# EAGLE design WSTL18_ISP (EAGLE 7.7.0)
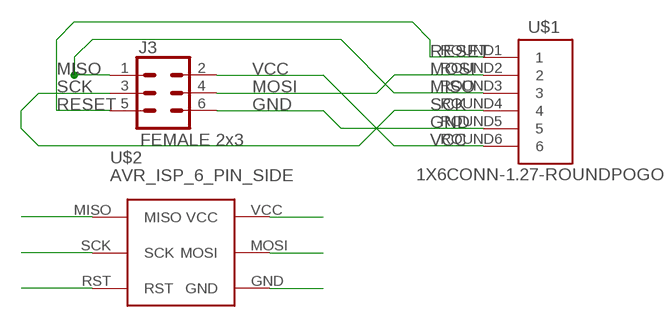
[diagram p0: schematic, sheet 1]

## Parts
J3  FEMALE 2x3  CONN_03X2FEMALE  [2X3]
U$1  1X6CONN-1.27-ROUNDPOGO  [1X6_1.27_SIDEPOGO]
U$2  AVR_ISP_6_PIN_SIDE  [AVR_ISP_SIDE_0.1_INCH]

## Nets
GND [GND]: J3.6 U$1.ROUND5 U$2.GND
MISO: J3.1 U$1.ROUND3 U$2.MISO
MOSI: J3.4 U$1.ROUND2 U$2.MOSI
RESET: J3.5 U$1.ROUND1 U$2.RST
SCK: J3.3 U$1.ROUND4 U$2.SCK
VCC: J3.2 U$1.ROUND6 U$2.VCC

## Library data of the parts
J3 = SparkFun-Connectors:CONN_03X2: Multi connection point. Often used as Generic Header-pin footprint for 0.1 inch spaced/style header connections You can populate with any combo of single row headers, but if you'd like an exact match, check these: Header - 2x3 (Male, 0.1") <https://www.sparkfun.com/products/12807> (PRT-12807) Header - 2x3 (Female, 0.1") <https://www.sparkfun.com/products/13010> (PRT-13010) 2x3 Pin Shrouded Header <https://www.sparkfun.com/products/10877> (PRT-10877) On any of the 0.1 inch spaced packages, you can populate with these: Break Away Headers - Straight <https://www.sparkfun.com/products/116> (PRT-00116) Break Away Male Headers - Right Angle <https://www.sparkfun.com/products/553> (PRT-00553) Female Headers <https://www.sparkfun.com/products/115> (PRT-00115) Break Away Headers - Machine Pin <https://www.sparkfun.com/products/117> (PRT-00117) Break Away Female Headers - Swiss Machine Pin <https://www.sparkfun.com/products/743> (PRT-00743) Special note: the shrouded connector mates well with our 3x2 ribbon cables: Ribbon Crimp Connector - 6-pin (2x3, Female) <https://www.sparkfun.com/products/10651> (PRT-10651) Ribbon Cable - 6 wire (15ft) <https://www.sparkfun.com/products/10646> (PRT-10646); PROD_ID: CONN-11566
U$1 = AVR_ISP_127:1X6CONN-1.27-ROUNDPOGO
U$2 = Connectors:AVR_ISP_6_PIN_SIDE

## Net classes
0 default: width 0.203 mm, drill 0.305 mm, clearance 0.203 mm
1 GND: width 0.254 mm, drill 0.305 mm, clearance 0.356 mm
2 Signal: width 0.203 mm, drill 0.305 mm, clearance 0.203 mm

## Board
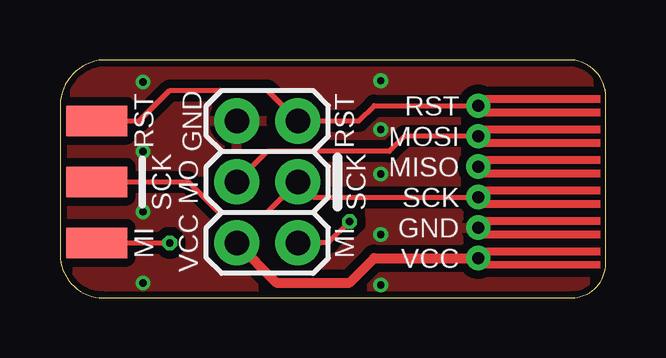
[diagram p1: board, top side]
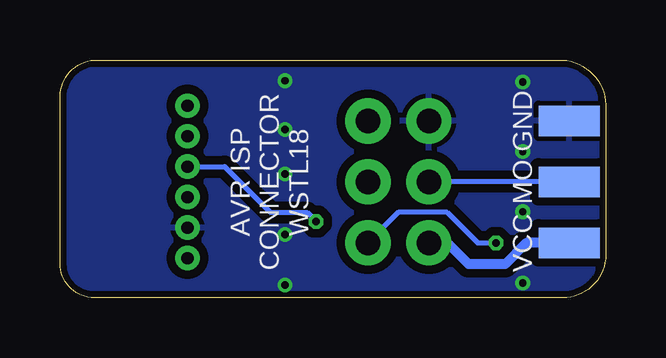
[diagram p2: board, bottom side, seen from below]

Size 22.74 x 9.91 mm. Coordinates in mm from the lower left corner, seen from the top.
Outline: 0,7.86 0,1.8 arc90 1.8,0 21.32,0 arc90 22.74,1.42 22.74,8.23 arc90 21.32,9.91 1.8,9.91 arc90 0,7.86
Copper layers (1*16): Top 0.035mm / dielectric 1.5mm / Bottom 0.035mm
Design rules "Nikos-SeeedStudio_2layer_DRU_no_angle_20140221": minimum track width 6mil, minimum drill 12mil, track to track 6mil, track to pad 10mil, pad to pad 10mil, via to via 10mil, smd to smd 6mil, copper to edge 10mil, drill to drill 10mil, minimum pad ring 10mil, minimum via ring 6mil, stop-mask expansion 0mil, vias tented up to drill 100mil, thermal gap 8mil

### Footprints (pad centres in the part's own frame; a part is rotated, then mirrored left to right if it is on the bottom)
2X3 = drill 1.016 pad 1.88: 1 0,0; 2 0,2.54; 3 2.54,0; 4 2.54,2.54; 5 5.08,0; 6 5.08,2.54
1X6_1.27_SIDEPOGO = drill 0.508 pad 0.813: ROUND1 0,0; ROUND2 1.27,0; ROUND3 2.54,0; ROUND4 3.81,0; ROUND5 5.08,0; ROUND6 6.35,0
AVR_ISP_SIDE_0.1_INCH = smd 1.27 x 2.54 bottom: GND -2.54,-1.27; MOSI 0,-1.27; VCC 2.54,-1.27 | smd 1.27 x 2.54: MISO 2.54,-1.27; RST -2.54,-1.27; SCK 0,-1.27

### Placement (x,y rotation side)
J3  9.91,2.29 90 top
U$1  17.43,8 270 top
U$2  2.8,4.83 270 top

### Tracks (layer width: path | path; a pad name or v marks a point on that pad's centre or on a via)
GND  (via drill 0.3)
  other vias: 13.36,5.16 13.36,7.01 13.36,0.53 3.46,3.58 3.46,0.61 3.46,8.99 13.36,2.64 3.46,6.1 13.36,9.04
  pour Bottom: 0,-0.25 0,9.91 22.74,9.91 22.74,-0.25
  pour Top: 0,9.91 22.61,9.91 22.61,-0.25 0,-0.25
MISO  (via drill 0.3)
  Top 0.203: v12.07,3.17 11.18,2.29 J3.1 | U$2.MISO v4.58,2.29
  Bottom 0.203: U$1.ROUND3 15.88,5.46 13.97,3.56 12.45,3.56 v12.07,3.17 | J3.1 8.64,3.56 6.61,3.56 5.34,2.29 v4.58,2.29
MOSI
  Top 0.203: U$1.ROUND2 14.35,6.73 13.72,6.1 8.64,6.1 J3.4
  Bottom 0.203: U$2.MOSI J3.4
RESET
  Top 0.203: U$1.ROUND1 13.08,8 12.45,7.37 J3.5 8.64,8.64 4.58,8.64 3.31,7.37 U$2.RST
SCK
  Top 0.203: U$1.ROUND4 10.54,4.19 J3.3 8.64,3.56 6.61,3.56 5.34,4.83 U$2.SCK
VCC
  Top 0.406: J3.2 9.02,0.64 12.07,0.64 13.08,1.65 U$1.ROUND6
  Bottom 0.406: U$2.VCC 3.31,2.29 4.19,1.4 5.72,1.4 6.61,2.29 J3.2

### Text on the board
tNames: RST | GND | RST | RST | MOSI | MISO | SCK | MO | SCK | SCK | MI | VCC | MI | GND | VCC
bNames: GND | MO | AVR ISP / CONNECTOR / WSTL18 | VCC
bDocu: WILDLIFE / SENSE / 2018